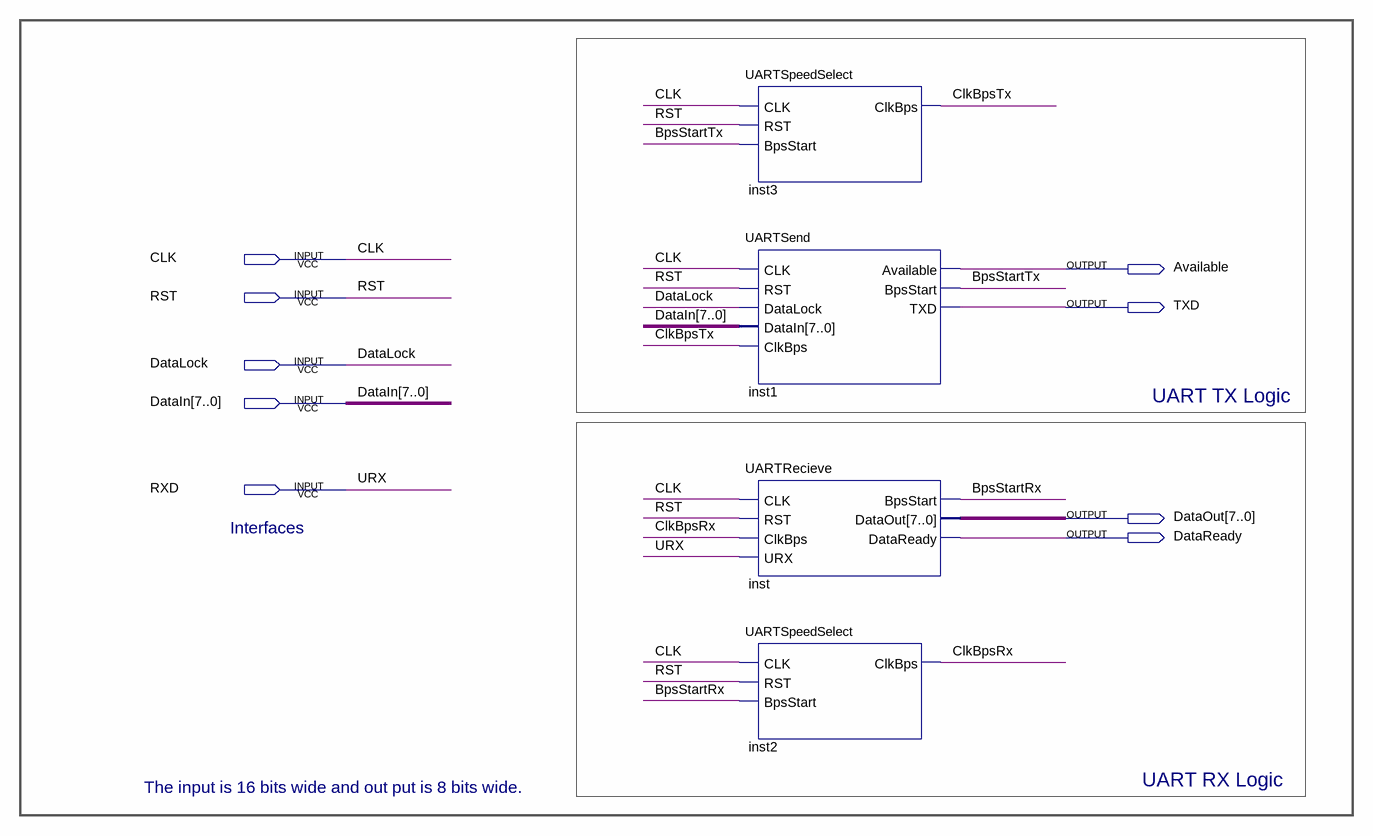
[diagram p0: schematic sheet]
// Quartus schematic UART.bdf as structural Verilog: 4 symbols, 9 pins
module UART (
  input  CLK,
  input  RST,
  input  DataLock,
  input  [7:0] DataIn,
  input  RXD,
  output Available,
  output TXD,
  output [7:0] DataOut,
  output DataReady
);

  wire BpsStartRx, BpsStartTx, ClkBpsRx, ClkBpsTx;

  UARTSpeedSelect inst3 (.CLK(CLK), .RST(RST), .BpsStart(BpsStartTx), .ClkBps(ClkBpsTx));
  UARTSend inst1 (
    .CLK(CLK), .RST(RST), .DataLock(DataLock), .DataIn(DataIn), .ClkBps(ClkBpsTx), .Available(Available),
    .BpsStart(BpsStartTx), .TXD(TXD));
  UARTRecieve inst (
    .CLK(CLK), .RST(RST), .ClkBps(ClkBpsRx), .URX(RXD), .BpsStart(BpsStartRx), .DataOut(DataOut),
    .DataReady(DataReady));
  UARTSpeedSelect inst2 (.CLK(CLK), .RST(RST), .BpsStart(BpsStartRx), .ClkBps(ClkBpsRx));

  // Other names for the same wires on the sheet: URX = RXD

  // Notes on the sheet:
  //   UART TX Logic
  //   Interfaces
  //   UART RX Logic
  //   The input is 16 bits wide and out put is 8 bits wide.
endmodule
